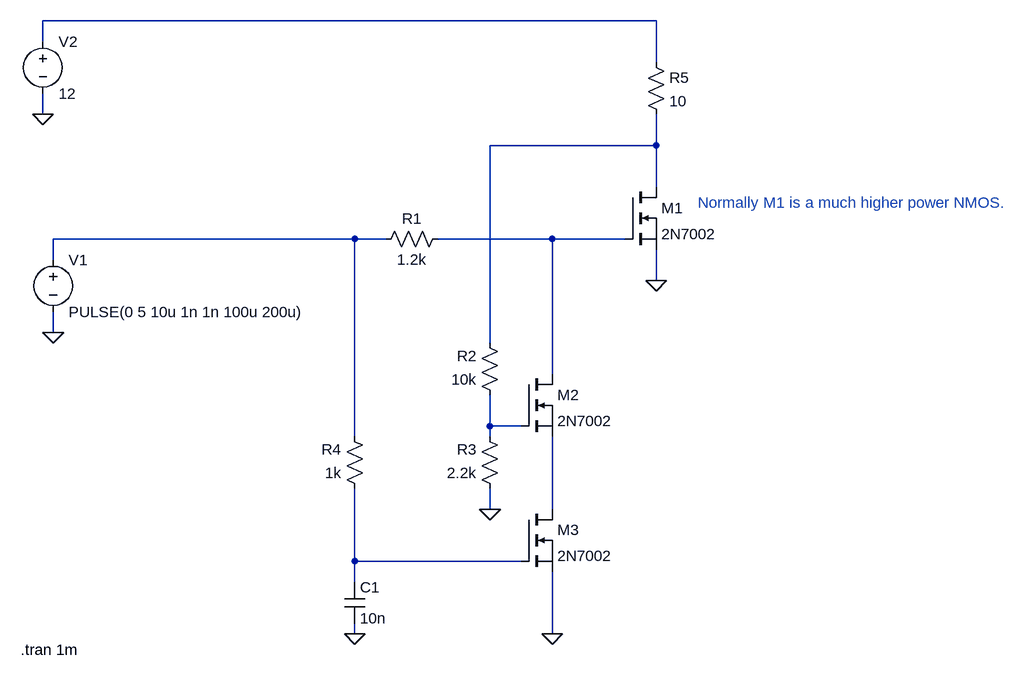
[diagram p0: schematic design1.asc]
design1.asc, the LTspice schematic file:
Version 4
SHEET 1 1088 680
WIRE 512 -400 -432 -400
WIRE -432 -368 -432 -400
WIRE 512 -336 512 -400
WIRE -432 -256 -432 -288
WIRE 512 -208 512 -256
WIRE 512 -208 256 -208
WIRE 512 -144 512 -208
WIRE 48 -64 -416 -64
WIRE 96 -64 48 -64
WIRE 352 -64 176 -64
WIRE 464 -64 352 -64
WIRE -416 -32 -416 -64
WIRE 512 0 512 -48
WIRE -416 80 -416 48
WIRE 256 96 256 -208
WIRE 352 144 352 -64
WIRE 256 224 256 176
WIRE 304 224 256 224
WIRE 48 240 48 -64
WIRE 256 240 256 224
WIRE 256 352 256 320
WIRE 352 352 352 240
WIRE 48 432 48 320
WIRE 304 432 48 432
WIRE 48 464 48 432
WIRE 48 544 48 528
WIRE 352 544 352 448
FLAG 512 0 0
FLAG 352 544 0
FLAG 256 352 0
FLAG -432 -256 0
FLAG -416 80 0
FLAG 48 544 0
SYMBOL res 192 -80 R90
WINDOW 0 0 56 VBottom 2
WINDOW 3 32 56 VTop 2
SYMATTR InstName R1
SYMATTR Value 1.2k
SYMBOL res 272 192 R180
WINDOW 0 36 76 Left 2
WINDOW 3 36 40 Left 2
SYMATTR InstName R2
SYMATTR Value 10k
SYMBOL res 272 336 R180
WINDOW 0 36 76 Left 2
WINDOW 3 36 40 Left 2
SYMATTR InstName R3
SYMATTR Value 2.2k
SYMBOL nmos 464 -144 R0
SYMATTR InstName M1
SYMATTR Value 2N7002
SYMBOL voltage -416 -48 R0
WINDOW 123 0 0 Left 0
WINDOW 39 0 0 Left 0
SYMATTR InstName V1
SYMATTR Value PULSE(0 5 10u 1n 1n 100u 200u)
SYMBOL voltage -432 -384 R0
SYMATTR InstName V2
SYMATTR Value 12
SYMBOL res 496 -352 R0
SYMATTR InstName R5
SYMATTR Value 10
SYMBOL nmos 304 144 R0
SYMATTR InstName M2
SYMATTR Value 2N7002
SYMBOL nmos 304 352 R0
SYMATTR InstName M3
SYMATTR Value 2N7002
SYMBOL res 64 336 R180
WINDOW 0 36 76 Left 2
WINDOW 3 36 40 Left 2
SYMATTR InstName R4
SYMATTR Value 1k
SYMBOL cap 32 464 R0
SYMATTR InstName C1
SYMATTR Value 10n
TEXT -466 568 Left 2 !.tran 1m
TEXT 576 -120 Left 2 ;Normally M1 is a much higher power NMOS.

The netlist it stands for:
* design1.asc
R1 N004 N003 1.2k
R2 N005 N002 10k
R3 0 N005 2.2k
M1 N002 N004 0 0 2N7002
V1 N003 0 PULSE(0 5 10u 1n 1n 100u 200u)
V2 N001 0 12
R5 N001 N002 10
M2 N004 N005 N006 N006 2N7002
M3 N006 N007 0 0 2N7002
R4 N007 N003 1k
C1 N007 0 10n
.model NMOS NMOS
.model PMOS PMOS
.lib standard.mos
.tran 1m
* Normally M1 is a much higher power NMOS.
.backanno
.end